# EAGLE schematic Drobit_V2.0 (EAGLE 7.5.0)

## Sheet 1 of 14: IMU
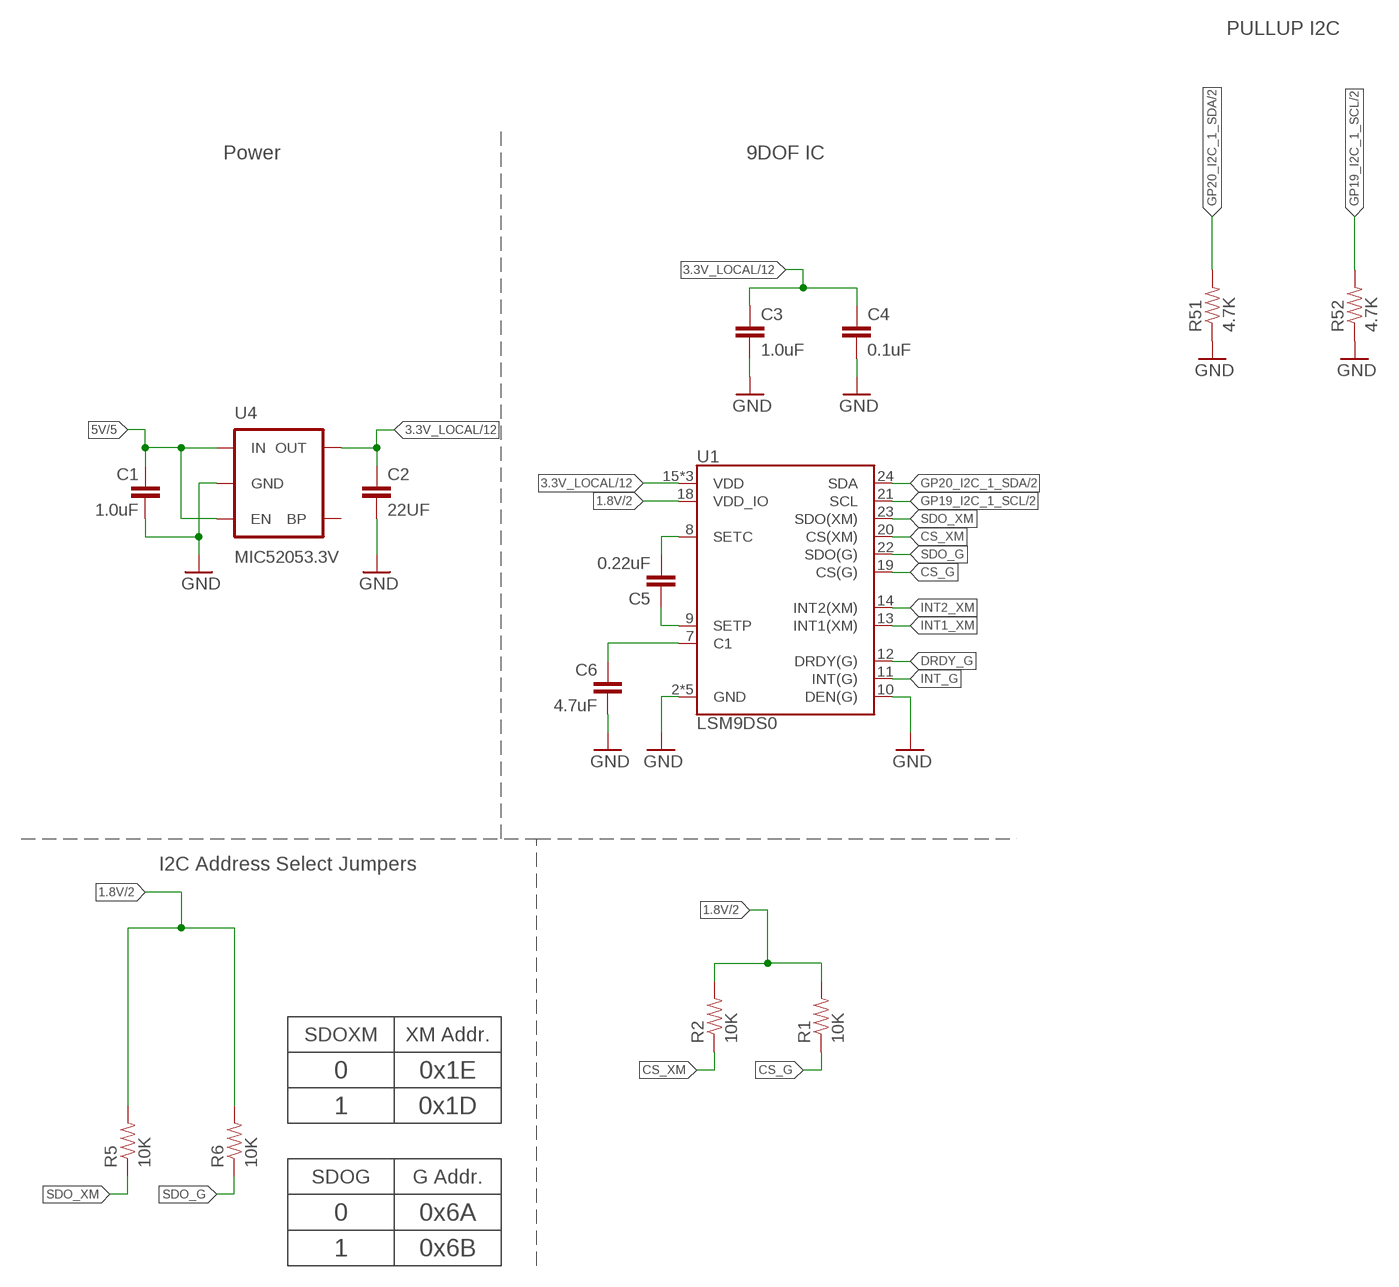
[diagram p0: schematic, sheet 1]

### Parts
C1  1.0uF  1.0UF-16V-10%(0603)  [0603-CAP]
C2  22UF  22UF-10V(0603)  [0603-CAP]
C3  1.0uF  1.0UF-16V-10%(0603)  [0603-CAP]
C4  0.1uF  0.1UF-25V(+80/-20%)(0603)  [0603-CAP]
C5  0.22uF  0.22UF-16V-10%(0603)  [0603-CAP]
C6  4.7uF  4.7UF-6.3V-10%(0603)0603  [0603-CAP]
R1  10K  10KOHM-1/10W-1%(0603)0603  [0603-RES]
R2  10K  10KOHM-1/10W-1%(0603)0603  [0603-RES]
R5  10K  10KOHM-1/10W-1%(0603)0603  [0603-RES]
R6  10K  10KOHM-1/10W-1%(0603)0603  [0603-RES]
R51  4.7K  4.7KOHM-1/10W-1%(0603)  [0603-RES]
R52  4.7K  4.7KOHM-1/10W-1%(0603)  [0603-RES]
U1  LSM9DS0  [LGA-24]
U4  MIC52053.3V  [SOT23-5]

### Nets
1.8V: R1.2 R2.2 R5.2 R6.2 U1.18(VDD_IO) ; also sheet 2,8,9,10,11,12
3.3V_LOCAL: C2.1 C3.1 C4.1 U1.15(VDD) U1.16(VDD) U1.17(VDD) U4.5(OUT) ; also sheet 12
5V [power]: C1.1 U4.1(IN) U4.3(EN) ; also sheet 5,6,7,10,11
CS_G: R1.1 U1.19(CS(G))
CS_XM: R2.1 U1.20(CS(XM))
DRDY_G: U1.12(DRDY(G))
GND: C1.2 C2.2 C3.2 C4.2 C6.2 R51.1 R52.1 U1.2(GND) U1.3(GND) U1.4(GND) U1.5(GND) U1.6(GND) U1.10(DEN(G)) U4.2(GND) ; also sheet 2,3,4,5,6,7,8,9,10,11,12,14
GP19_I2C_1_SCL: R52.2 U1.21(SCL) ; also sheet 2
GP20_I2C_1_SDA: R51.2 U1.24(SDA) ; also sheet 2
INT1_XM: U1.13(INT1(XM))
INT2_XM: U1.14(INT2(XM))
INT_G: U1.11(INT(G))
N$1: C5.1 U1.9(SETP)
N$2: C5.2 U1.8(SETC)
N$3: C6.1 U1.7(C1)
SDO_G: R6.1 U1.22(SDO(G))
SDO_XM: R5.1 U1.23(SDO(XM))
Unconnected: U4.4(BP)

### Notes on the sheet
- PULLUP I2C
- Power | 9DOF IC
- I2C Address Select Jumpers
- SDOXM | XM Addr.
- 0 | 0x1E
- 1 | 0x1D
- SDOG | G Addr.
- 0 | 0x6A
- 1 | 0x6B

## Sheet 2 of 14: EDISON
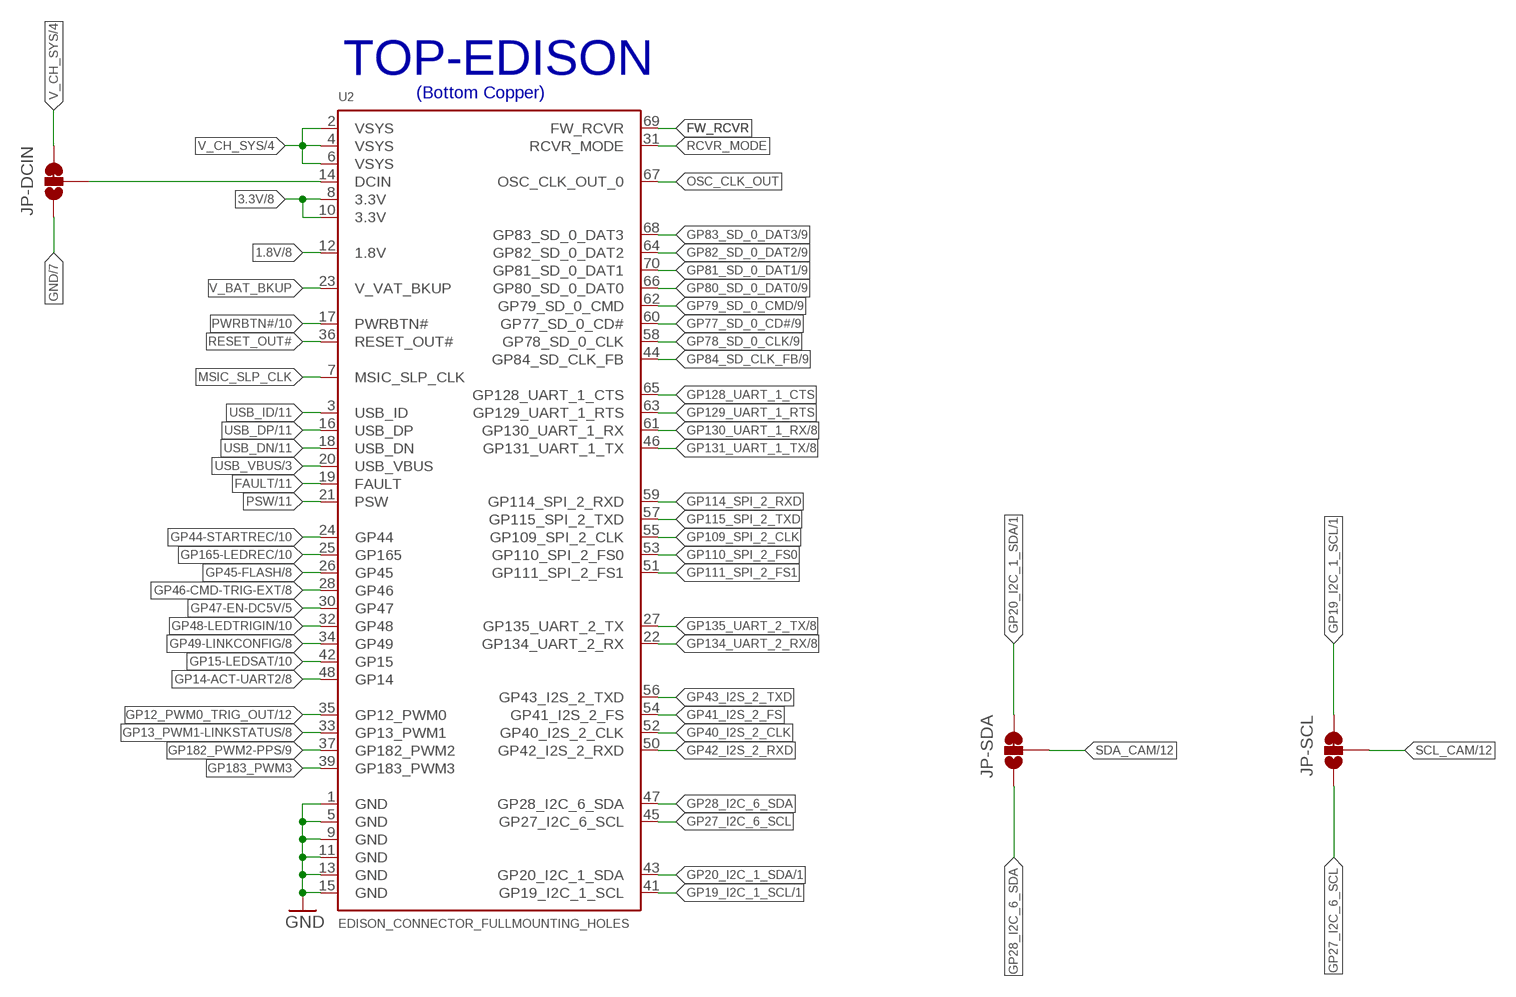
[diagram p1: schematic, sheet 2]

### Parts
JP-DCIN  JUMPER-PAD-3-2OF3_NC_BY_TRACE_SMALL  [PAD-JUMPER-3-2OF3_NC_BY_TRACE_YES_SILK_FULL_BOX]
JP-SCL  JUMPER-PAD-3-2OF3_NC_BY_TRACE_SMALL  [PAD-JUMPER-3-2OF3_NC_BY_TRACE_YES_SILK_FULL_BOX]
JP-SDA  JUMPER-PAD-3-2OF3_NC_BY_TRACE_SMALL  [PAD-JUMPER-3-2OF3_NC_BY_TRACE_YES_SILK_FULL_BOX]
U2  EDISON_CONNECTOR_FULLMOUNTING_HOLES  [EDISON_DAUGHTER]

### Nets
1.8V: U2.12(1.8V) ; also sheet 1,8,9,10,11,12
3.3V: U2.8(3.3V) U2.10(3.3V) ; also sheet 8,9,10,12
FAULT: U2.19(FAULT) ; also sheet 11
FW_RCVR: U2.69(FW_RCVR)
GND: JP-DCIN.1 U2.1(GND) U2.5(GND) U2.9(GND) U2.11(GND) U2.13(GND) U2.15(GND) ; also sheet 1,3,4,5,6,7,8,9,10,11,12,14
GP12_PWM0_TRIG_OUT: U2.35(GP12_PWM0) ; also sheet 12
GP13_PWM1-LINKSTATUS: U2.33(GP13_PWM1) ; also sheet 8
GP14-ACT-UART2: U2.48(GP14) ; also sheet 8
GP15-LEDSAT: U2.42(GP15) ; also sheet 10
GP19_I2C_1_SCL: JP-SCL.3 U2.41(GP19_I2C_1_SCL) ; also sheet 1
GP20_I2C_1_SDA: JP-SDA.3 U2.43(GP20_I2C_1_SDA) ; also sheet 1
GP27_I2C_6_SCL: JP-SCL.1 U2.45(GP27_I2C_6_SCL)
GP28_I2C_6_SDA: JP-SDA.1 U2.47(GP28_I2C_6_SDA)
GP40_I2S_2_CLK: U2.52(GP40_I2S_2_CLK)
GP41_I2S_2_FS: U2.54(GP41_I2S_2_FS)
GP42_I2S_2_RXD: U2.50(GP42_I2S_2_RXD)
GP43_I2S_2_TXD: U2.56(GP43_I2S_2_TXD)
GP44-STARTREC: U2.24(GP44) ; also sheet 10,12
GP45-FLASH: U2.26(GP45) ; also sheet 8
GP46-CMD-TRIG-EXT: U2.28(GP46) ; also sheet 8
GP47-EN-DC5V: U2.30(GP47) ; also sheet 5
GP48-LEDTRIGIN: U2.32(GP48) ; also sheet 10
GP49-LINKCONFIG: U2.34(GP49) ; also sheet 8
GP77_SD_0_CD#: U2.60(GP77_SD_0_CD#) ; also sheet 9
GP78_SD_0_CLK: U2.58(GP78_SD_0_CLK) ; also sheet 9
GP79_SD_0_CMD: U2.62(GP79_SD_0_CMD) ; also sheet 9
GP80_SD_0_DAT0: U2.66(GP80_SD_0_DAT0) ; also sheet 9
GP81_SD_0_DAT1: U2.70(GP81_SD_0_DAT1) ; also sheet 9
GP82_SD_0_DAT2: U2.64(GP82_SD_0_DAT2) ; also sheet 9
GP83_SD_0_DAT3: U2.68(GP83_SD_0_DAT3) ; also sheet 9
GP84_SD_CLK_FB: U2.44(GP84_SD_CLK_FB) ; also sheet 9
GP109_SPI_2_CLK: U2.55(GP109_SPI_2_CLK)
GP110_SPI_2_FS0: U2.53(GP110_SPI_2_FS0)
GP111_SPI_2_FS1: U2.51(GP111_SPI_2_FS1)
GP114_SPI_2_RXD: U2.59(GP114_SPI_2_RXD)
GP115_SPI_2_TXD: U2.57(GP115_SPI_2_TXD)
GP128_UART_1_CTS: U2.65(GP128_UART_1_CTS)
GP129_UART_1_RTS: U2.63(GP129_UART_1_RTS)
GP130_UART_1_RX: U2.61(GP130_UART_1_RX) ; also sheet 8
GP131_UART_1_TX: U2.46(GP131_UART_1_TX) ; also sheet 8
GP134_UART_2_RX: U2.22(GP134_UART_2_RX) ; also sheet 8
GP135_UART_2_TX: U2.27(GP135_UART_2_TX) ; also sheet 8
GP165-LEDREC: U2.25(GP165) ; also sheet 10
GP182_PWM2-PPS: U2.37(GP182_PWM2) ; also sheet 9
GP183_PWM3: U2.39(GP183_PWM3)
MSIC_SLP_CLK: U2.7(MSIC_SLP_CLK)
N$32: JP-DCIN.2 U2.14(DCIN)
OSC_CLK_OUT: U2.67(OSC_CLK_OUT_0)
PSW: U2.21(PSW) ; also sheet 11
PWRBTN#: U2.17(PWRBTN#) ; also sheet 10
RCVR_MODE: U2.31(RCVR_MODE)
RESET_OUT#: U2.36(RESET_OUT#)
SCL_CAM: JP-SCL.2 ; also sheet 12
SDA_CAM: JP-SDA.2 ; also sheet 12
USB_DN: U2.18(USB_DN) ; also sheet 11
USB_DP: U2.16(USB_DP) ; also sheet 11
USB_ID: U2.3(USB_ID) ; also sheet 11
USB_VBUS: U2.20(USB_VBUS) ; also sheet 3,11
V_BAT_BKUP: U2.23(V_VAT_BKUP)
V_CH_SYS: JP-DCIN.3 U2.2(VSYS) U2.4(VSYS) U2.6(VSYS) ; also sheet 4,5,10

### Notes on the sheet
- TOP-EDISON
- (Bottom Copper)

## Sheet 3 of 14: IN Protection
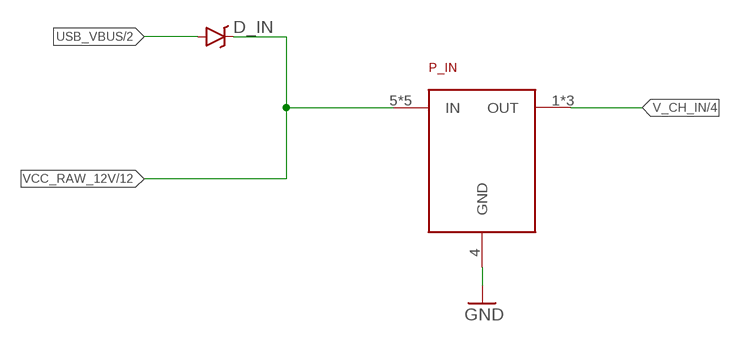
[diagram p2: schematic, sheet 3]

### Parts
D_IN  V8PAN50-M3/I  [V8PAN50-M3/I]
P_IN  FR014H5JZ  [FR014H5JZ]

### Nets
GND: P_IN.4(GND) ; also sheet 1,2,4,5,6,7,8,9,10,11,12,14
USB_VBUS: D_IN.A ; also sheet 2,11
V_CH_IN: P_IN.1(OUT) P_IN.2(OUT) P_IN.3(OUT) ; also sheet 4
VCC_RAW_12V: D_IN.C P_IN.5(IN) P_IN.6(IN) P_IN.7(IN) P_IN.8(IN) P_IN.PAD(IN) ; also sheet 12

## Sheet 4 of 14: CHARGER
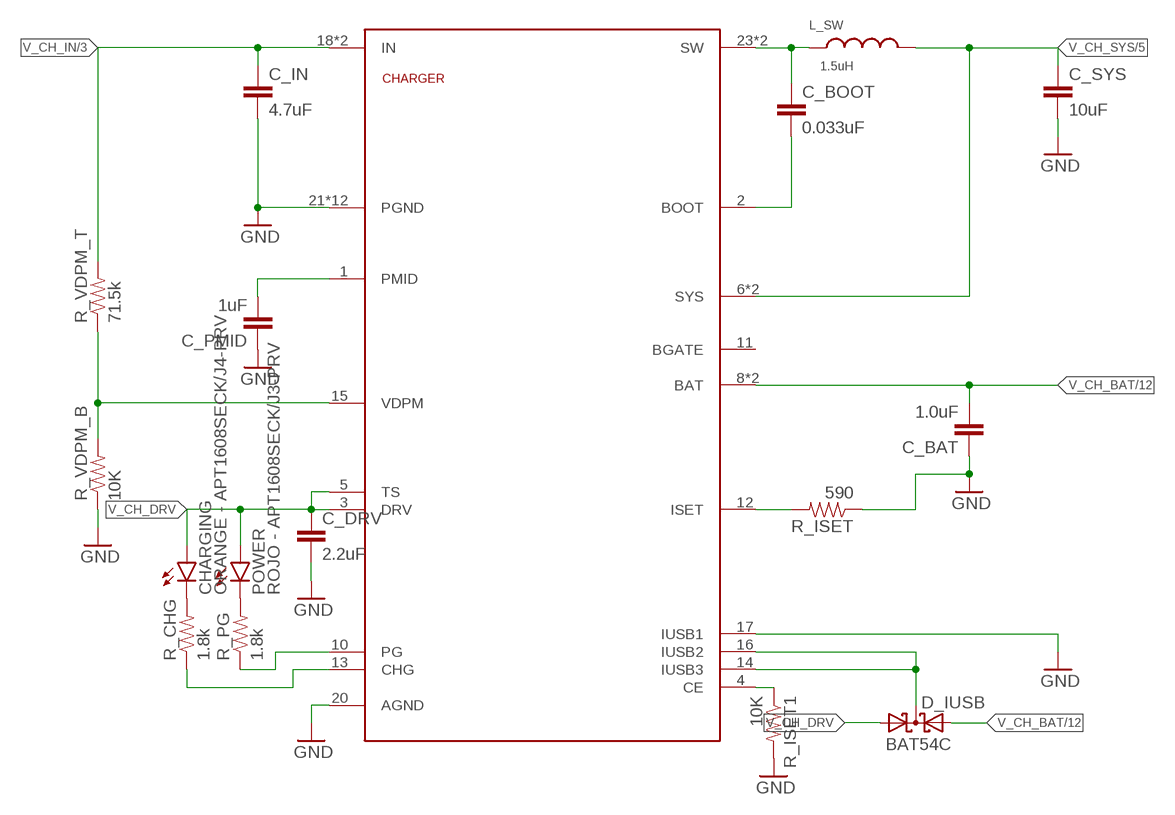
[diagram p3: schematic, sheet 4]

### Parts
C_BAT  1.0uF  1.0UF-16V-10%(0603)  [0603-CAP]
C_BOOT  0.033uF  33NF-50V-10%(0603)  [0603-CAP]
C_DRV  2.2uF  2.2UF-10V-20%(0603)  [0603-CAP]
C_IN  4.7uF  4.7UF-50V(0603)0603  [0603-CAP]
C_PMID  1uF  1UF-25V-10%(0603)  [0603-CAP]
C_SYS  10uF  10UF16V10%(1210)  [1210]
CHARGER  BQ24266  [QFN50P400X400X100-25N]
CHARGING  ORANGE - APT1608SECK/J4-PRV  LED0603  [LED-0603]
D_IUSB  BAT54C  [SOT23]
L_SW  1.5uH  FDSD0420-H-1R5M  [FDSD0420]
POWER  ROJO - APT1608SECK/J3-PRV  LED0603  [LED-0603]
R_CHG  1.8k  1.8KOHM1/10W1%(0603)  [0603-RES]
R_ISET  590  590OHM1/10W1%(0603)  [0603-RES]
R_ISET1  10K  10KOHM-1/10W-1%(0603)0603  [0603-RES]
R_PG  1.8k  1.8KOHM1/10W1%(0603)  [0603-RES]
R_VDPM_B  10K  10KOHM-1/10W-0.1%(0603)0603  [0603-RES]
R_VDPM_T  71.5k  71.5KOHM1/10W1%(0603)  [0603-RES]

### Nets
GND: C_BAT.1 C_DRV.2 C_IN.2 C_PMID.1 C_SYS.2 CHARGER.17(IUSB1) CHARGER.20(AGND) CHARGER.21(PGND) CHARGER.22(PGND) CHARGER.25(PGND) CHARGER.P$2(PGND) CHARGER.P$3(PGND) CHARGER.P$4(PGND) CHARGER.P$5(PGND) CHARGER.P$6(PGND) CHARGER.P$7(PGND) CHARGER.P$8(PGND) CHARGER.P$9(PGND) CHARGER.P$10(PGND) R_ISET1.2 R_ISET.1 R_VDPM_B.1 ; also sheet 1,2,3,5,6,7,8,9,10,11,12,14
N$16: CHARGER.4(CE) R_ISET1.1
N$17: POWER.C R_PG.2
N$18: CHARGING.C R_CHG.2
N$19: CHARGER.10(PG) R_PG.1
N$20: CHARGER.13(CHG) R_CHG.1
N$22: C_BOOT.2 CHARGER.2(BOOT)
N$24: CHARGER.12(ISET) R_ISET.2
N$25: CHARGER.14(IUSB3) CHARGER.16(IUSB2) D_IUSB.3(CC)
V_CH_BAT: C_BAT.2 CHARGER.8(BAT) CHARGER.9(BAT) D_IUSB.2(A2) ; also sheet 12
V_CH_DPM: CHARGER.15(VDPM) R_VDPM_B.2 R_VDPM_T.1
V_CH_DRV: C_DRV.1 CHARGER.3(DRV) CHARGER.5(TS) CHARGING.A D_IUSB.1(A1) POWER.A
V_CH_IN: C_IN.1 CHARGER.18(IN) CHARGER.19(IN) R_VDPM_T.2 ; also sheet 3
V_CH_PMID: C_PMID.2 CHARGER.1(PMID)
V_CH_SW: C_BOOT.1 CHARGER.23(SW) CHARGER.24(SW) L_SW.1
V_CH_SYS: C_SYS.1 CHARGER.6(SYS) CHARGER.7(SYS) L_SW.2 ; also sheet 2,5,10
Unconnected: CHARGER.11(BGATE)

## Sheet 5 of 14: DCDC-5V
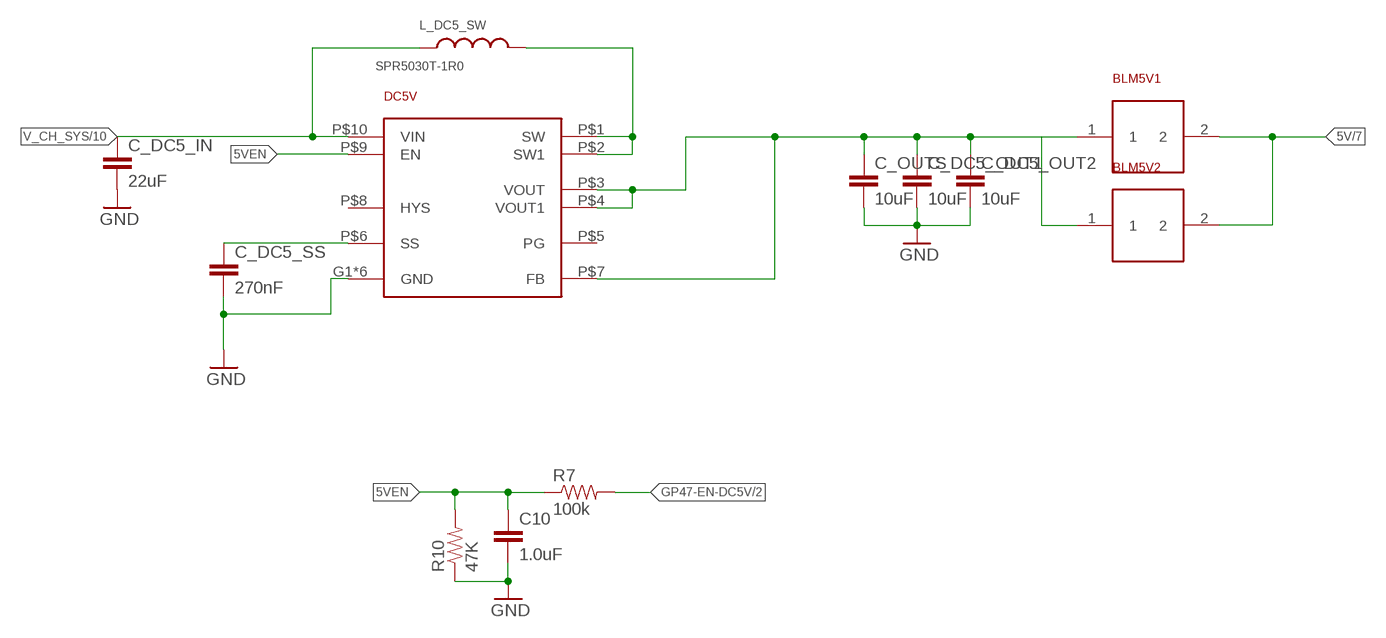
[diagram p4: schematic, sheet 5]

### Parts
BLM5V1  BLM18SG221TZ1-2.5A  [0603]
BLM5V2  BLM18SG221TZ1-2.5A  [0603]
C10  1.0uF  1.0UF-16V-10%(0603)  [0603-CAP]
C_DC5_IN  22uF  22UF-25V-20%-(1210)  [1210]
C_DC5_OUT1  10uF  10UF10V10%(1210)  [1210]
C_DC5_OUT2  10uF  10UF10V10%(1210)  [1210]
C_DC5_SS  270nF  270NF-16V(0603)  [0603-CAP]
C_OUTS  10uF  10UF10V10%(1210)  [1210]
DC5V  TPS61232  [SON-10]
L_DC5_SW  SPR5030T-1R0  [SRP5030T-1R0]
R7  100k  100KOHM-1/10W-1%(0603)  [0603-RES]
R10  47K  47KOHM1/10W1%(0603)  [0603-RES]

### Nets
5V [power]: BLM5V1.2 BLM5V2.2 ; also sheet 1,6,7,10,11
5VEN: C10.1 DC5V.P$9(EN) R7.1 R10.2
5VRAW: BLM5V1.1 BLM5V2.1 C_DC5_OUT1.1 C_DC5_OUT2.1 C_OUTS.1 DC5V.P$3(VOUT) DC5V.P$4(VOUT1) DC5V.P$7(FB)
GND: C10.2 C_DC5_IN.2 C_DC5_OUT1.2 C_DC5_OUT2.2 C_DC5_SS.2 C_OUTS.2 DC5V.G1(GND) DC5V.G2(GND) DC5V.G3(GND) DC5V.G4(GND) DC5V.G5(GND) DC5V.PAD(GND) R10.1 ; also sheet 1,2,3,4,6,7,8,9,10,11,12,14
GP47-EN-DC5V: R7.2 ; also sheet 2
V_CH_SYS: C_DC5_IN.1 DC5V.P$10(VIN) L_DC5_SW.P$1 ; also sheet 2,4,10
V_DC5_SS: C_DC5_SS.1 DC5V.P$6(SS)
V_DC5_SW: DC5V.P$1(SW) DC5V.P$2(SW1) L_DC5_SW.P$2
Unconnected: DC5V.P$5(PG) DC5V.P$8(HYS)

## Sheet 6 of 14: 5V-LIMIT
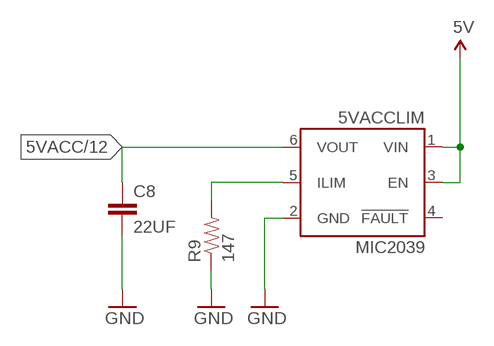
[diagram p5: schematic, sheet 6]

### Parts
5VACCLIM  MIC2039  [SOT23-6]
C8  22UF  22UF-10V(0603)  [0603-CAP]
R9  147  147OHM-1/16W-1%(0603)  [0603-RES]

### Nets
5V [power]: 5VACCLIM.1(VIN) 5VACCLIM.3(EN) ; also sheet 1,5,7,10,11
5VACC: 5VACCLIM.6(VOUT) C8.1 ; also sheet 12,14
GND: 5VACCLIM.2(GND) C8.2 R9.1 ; also sheet 1,2,3,4,5,7,8,9,10,11,12,14
N$31: 5VACCLIM.5(ILIM) R9.2
Unconnected: 5VACCLIM.4(!FAULT)

## Sheet 7 of 14: GNSS
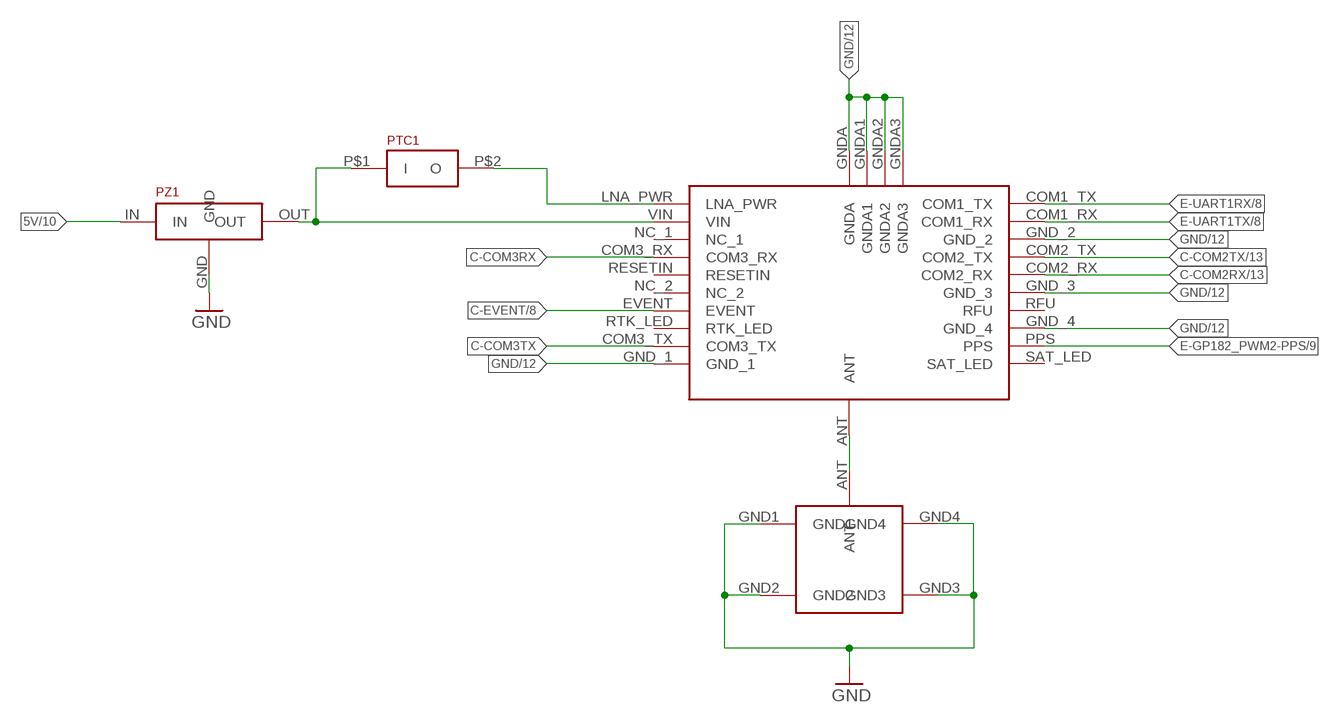
[diagram p6: schematic, sheet 7]

### Parts
PTC1  0603L010YR  [0602]
PZ1  ZEN056V230A16YC  [ZEN056V230A16YC]
U$1  COMNAV_501G  [COMNAV_501G]
U$2  MCX-TECON-1-1337586-0  [1-1337586-0]

### Nets
5V [power]: PZ1.IN ; also sheet 1,5,6,10,11
C-COM2RX: U$1.COM2_RX ; also sheet 13
C-COM2TX: U$1.COM2_TX ; also sheet 13
C-COM3RX: U$1.COM3_RX
C-COM3TX: U$1.COM3_TX
C-EVENT: U$1.EVENT ; also sheet 8,12,13
E-GP182_PWM2-PPS: U$1.PPS ; also sheet 9,13
E-UART1RX: U$1.COM1_TX ; also sheet 8
E-UART1TX: U$1.COM1_RX ; also sheet 8
GND: PZ1.GND U$1.GND_1 U$1.GND_2 U$1.GND_3 U$1.GND_4 U$1.GNDA U$1.GNDA1 U$1.GNDA2 U$1.GNDA3 U$2.GND1 U$2.GND2 U$2.GND3 U$2.GND4 ; also sheet 1,2,3,4,5,6,8,9,10,11,12,14
N$29: PTC1.P$2(O) U$1.LNA_PWR
N$30: PTC1.P$1(I) PZ1.OUT U$1.VIN
N$40: U$1.ANT U$2.ANT
Unconnected: U$1.NC_1 U$1.NC_2 U$1.RESETIN U$1.RFU U$1.RTK_LED U$1.SAT_LED

## Sheet 8 of 14: GPIO-UART
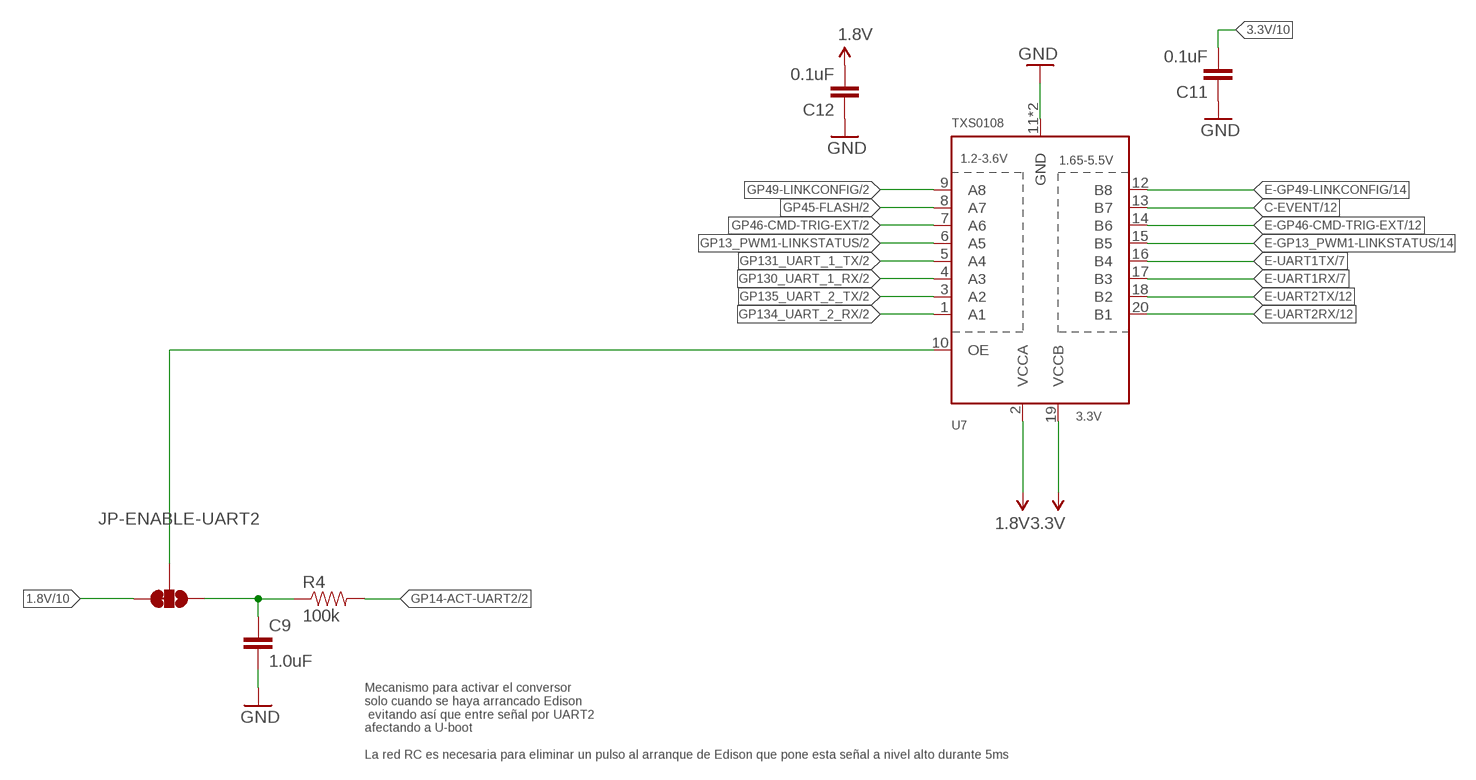
[diagram p7: schematic, sheet 8]

### Parts
C9  1.0uF  1.0UF-16V-10%(0603)  [0603-CAP]
C11  0.1uF  0.1UF-25V(+80/-20%)(0603)  [0603-CAP]
C12  0.1uF  0.1UF-25V(+80/-20%)(0603)  [0603-CAP]
JP-ENABLE-UART2  JUMPER-PAD-3-2OF3_NC_BY_TRACE_SMALL  [PAD-JUMPER-3-2OF3_NC_BY_TRACE_YES_SILK_FULL_BOX]
R4  100k  100KOHM-1/10W-1%(0603)  [0603-RES]
U7  TXS0108  [R-PVQFN-N20]

### Nets
1.8V: C12.2 JP-ENABLE-UART2.3 U7.2(VCCA) ; also sheet 1,2,9,10,11,12
3.3V: C11.2 U7.19(VCCB) ; also sheet 2,9,10,12
C-EVENT: U7.13(B7) ; also sheet 7,12,13
E-GP13_PWM1-LINKSTATUS: U7.15(B5) ; also sheet 14
E-GP46-CMD-TRIG-EXT: U7.14(B6) ; also sheet 12,13
E-GP49-LINKCONFIG: U7.12(B8) ; also sheet 14
E-UART1RX: U7.17(B3) ; also sheet 7
E-UART1TX: U7.16(B4) ; also sheet 7
E-UART2RX: U7.20(B1) ; also sheet 12,14
E-UART2TX: U7.18(B2) ; also sheet 12,14
GND: C9.2 C11.1 C12.1 U7.11(GND) U7.EPAD(GND) ; also sheet 1,2,3,4,5,6,7,9,10,11,12,14
GP13_PWM1-LINKSTATUS: U7.6(A5) ; also sheet 2
GP14: JP-ENABLE-UART2.2 U7.10(OE)
GP14-ACT-UART2: R4.2 ; also sheet 2
GP45-FLASH: U7.8(A7) ; also sheet 2
GP46-CMD-TRIG-EXT: U7.7(A6) ; also sheet 2
GP49-LINKCONFIG: U7.9(A8) ; also sheet 2
GP130_UART_1_RX: U7.4(A3) ; also sheet 2
GP131_UART_1_TX: U7.5(A4) ; also sheet 2
GP134_UART_2_RX: U7.1(A1) ; also sheet 2
GP135_UART_2_TX: U7.3(A2) ; also sheet 2
N$13: C9.1 JP-ENABLE-UART2.1 R4.1

### Notes on the sheet
- Mecanismo para activar el conversor
  solo cuando se haya arrancado Edison
   evitando así que entre señal por UART2
  afectando a U-boot
  
  La red RC es necesaria para eliminar un pulso al arranque de Edison que pone esta señal a nivel alto durante 5ms

## Sheet 9 of 14: SDCARD
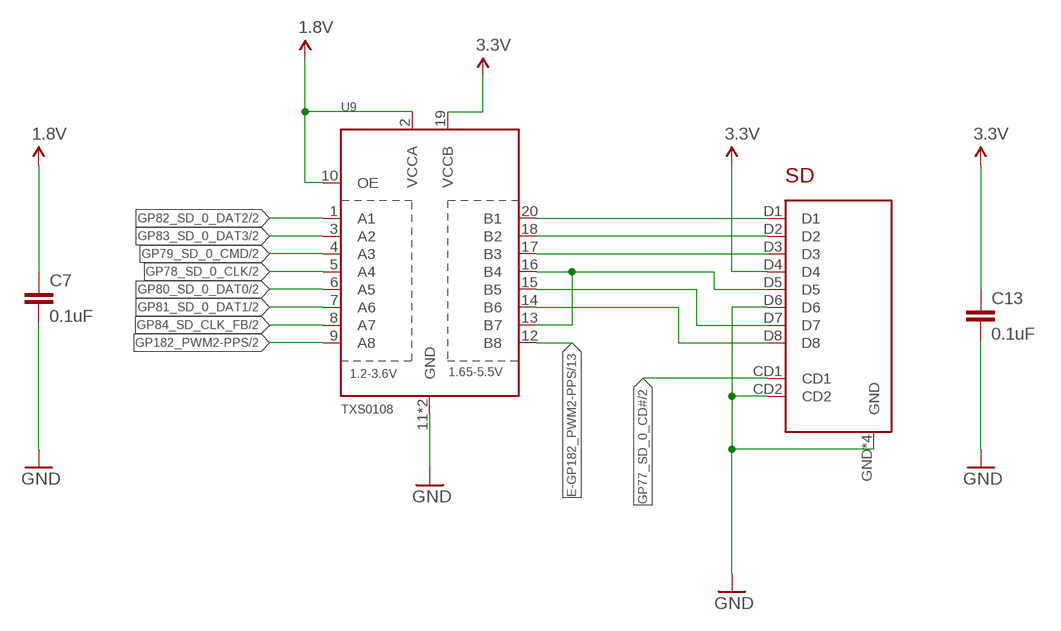
[diagram p8: schematic, sheet 9]

### Parts
C7  0.1uF  0.1UF-25V(+80/-20%)(0603)  [0603-CAP]
C13  0.1uF  0.1UF-25V(+80/-20%)(0603)  [0603-CAP]
SD  SDCARD  [1040310811]
U9  TXS0108  [R-PVQFN-N20]

### Nets
1.8V: C7.1 U9.2(VCCA) U9.10(OE) ; also sheet 1,2,8,10,11,12
3.3V: C13.1 SD.D4 U9.19(VCCB) ; also sheet 2,8,10,12
E-GP182_PWM2-PPS: U9.12(B8) ; also sheet 7,13
GND: C7.2 C13.2 SD.CD2 SD.D6 SD.GND SD.GND1(GND) SD.GND2(GND) SD.GND3(GND) U9.11(GND) U9.EPAD(GND) ; also sheet 1,2,3,4,5,6,7,8,10,11,12,14
GP77_SD_0_CD#: SD.CD1 ; also sheet 2
GP78_SD_0_CLK: U9.5(A4) ; also sheet 2
GP79_SD_0_CMD: U9.4(A3) ; also sheet 2
GP80_SD_0_DAT0: U9.6(A5) ; also sheet 2
GP81_SD_0_DAT1: U9.7(A6) ; also sheet 2
GP82_SD_0_DAT2: U9.1(A1) ; also sheet 2
GP83_SD_0_DAT3: U9.3(A2) ; also sheet 2
GP84_SD_CLK_FB: U9.8(A7) ; also sheet 2
GP182_PWM2-PPS: U9.9(A8) ; also sheet 2
N$4: SD.D1 U9.20(B1)
N$5: SD.D2 U9.18(B2)
N$10: SD.D3 U9.17(B3)
N$11: SD.D7 U9.15(B5)
N$14: SD.D8 U9.14(B6)
SCK: SD.D5 U9.13(B7) U9.16(B4)

## Sheet 10 of 14: Buttons&LEDs
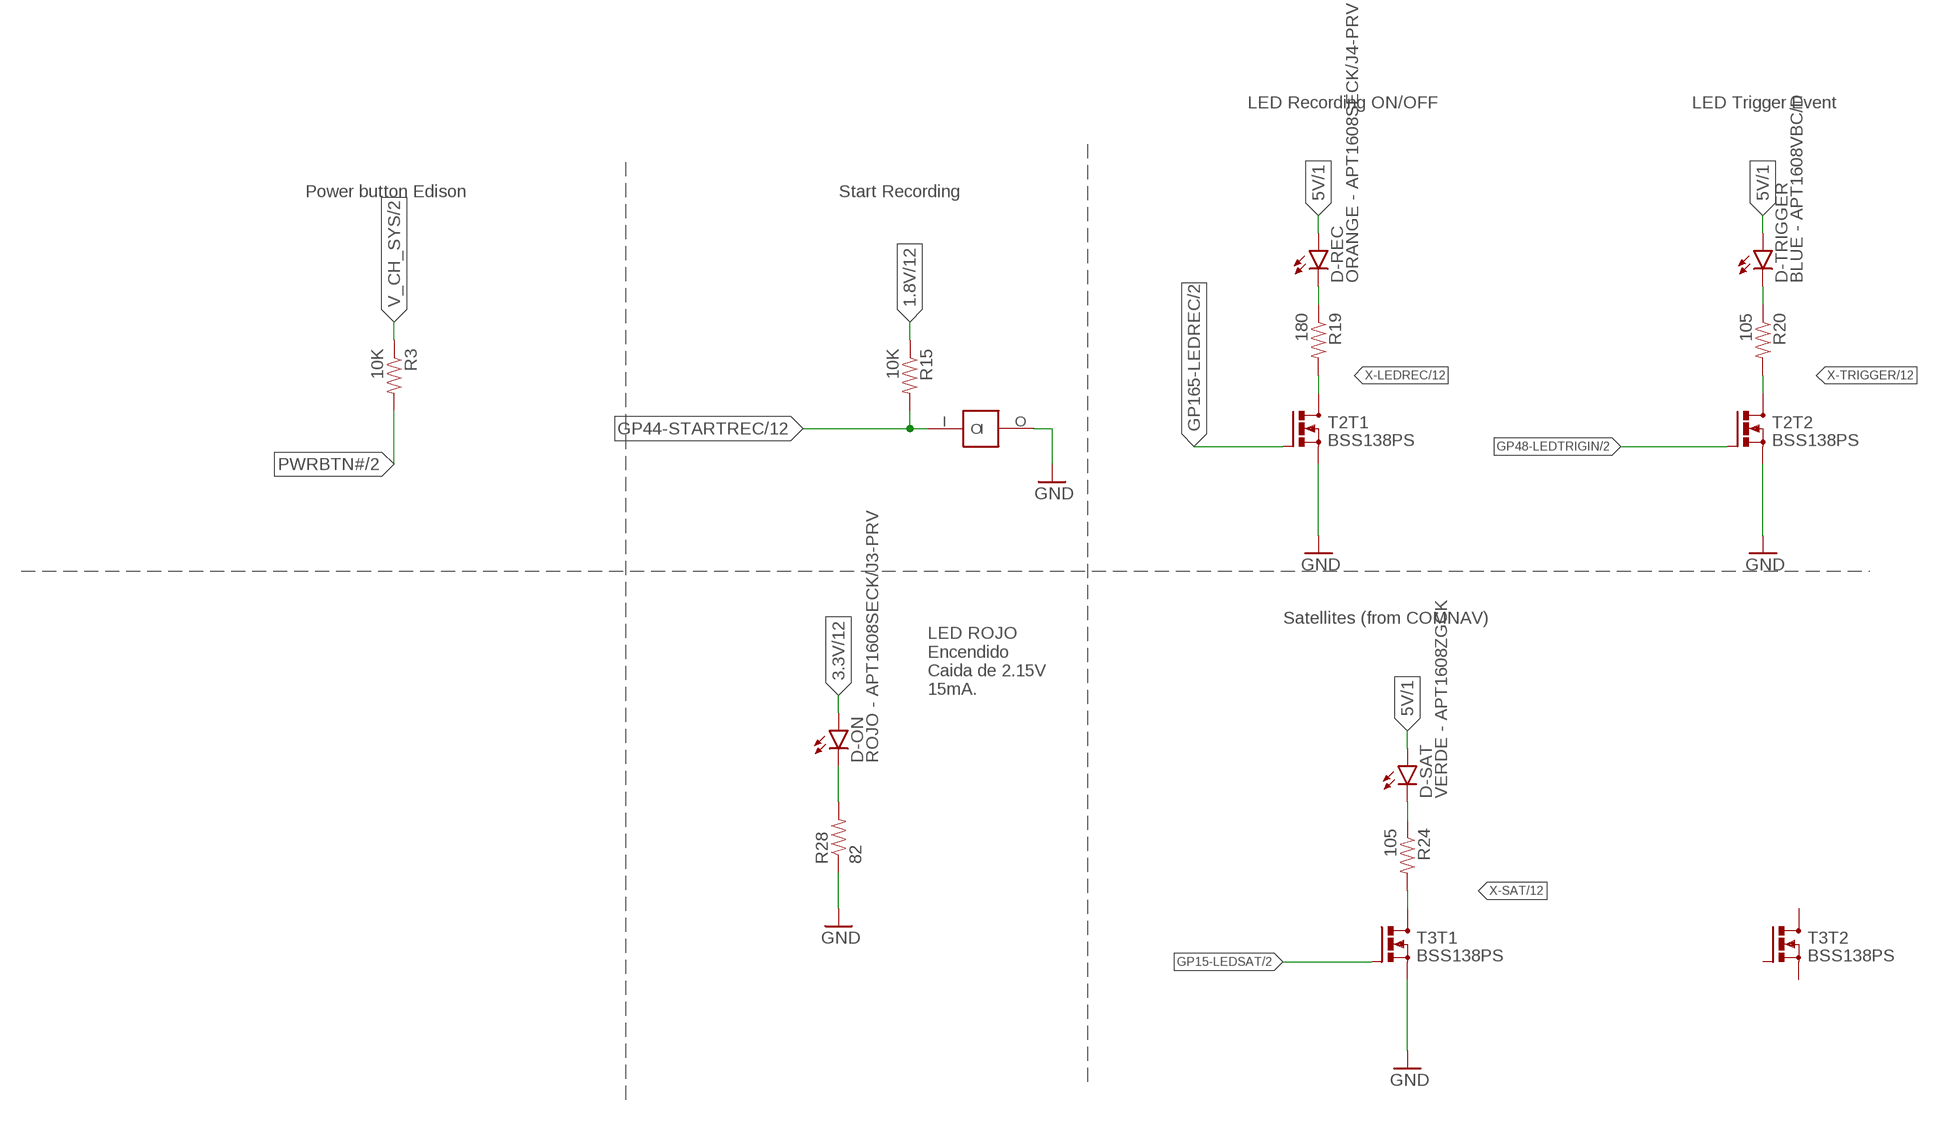
[diagram p9: schematic, sheet 10]

### Parts
D-ON  ROJO - APT1608SECK/J3-PRV  LED0603  [LED-0603]
D-REC  ORANGE - APT1608SECK/J4-PRV  LED0603  [LED-0603]
D-SAT  VERDE - APT1608ZGCK  LED0603  [LED-0603]
D-TRIGGER  BLUE - APT1608VBC/D  LED0603  [LED-0603]
R3  10K  10KOHM-1/10W-1%(0603)0603  [0603-RES]
R15  10K  10KOHM-1/10W-1%(0603)0603  [0603-RES]
R19  180  180OHM1/10W1%(0603)  [0603-RES]
R20  105  105OHM-1/10W-1%(0603)  [0603-RES]
R24  105  105OHM-1/10W-1%(0603)  [0603-RES]
R28  82  82OHM-1/10W-1%(0603)SMD  [0603-RES]
SREC  SKRKAEE010  [SKRKAEE010]
T2  BSS138PS  [SOT363]
T3  BSS138PS  [SOT363]

### Nets
1.8V: R15.1 ; also sheet 1,2,8,9,11,12
3.3V: D-ON.A ; also sheet 2,8,9,12
5V [power]: D-REC.A D-SAT.A D-TRIGGER.A ; also sheet 1,5,6,7,11
GND: R28.1 SREC.O T2.1(T1:S) T2.4(T2:S) T3.1(T1:S) ; also sheet 1,2,3,4,5,6,7,8,9,11,12,14
GP15-LEDSAT: T3.2(T1:G) ; also sheet 2
GP44-STARTREC: R15.2 SREC.I ; also sheet 2,12
GP48-LEDTRIGIN: T2.5(T2:G) ; also sheet 2
GP165-LEDREC: T2.2(T1:G) ; also sheet 2
N$9: D-ON.C R28.2
PWRBTN#: R3.2 ; also sheet 2
V_CH_SYS: R3.1 ; also sheet 2,4,5
X-LEDREC: R19.2 T2.6(T1:D) ; also sheet 12
X-LEDREC--: D-REC.C R19.1
X-SAT: R24.2 T3.6(T1:D) ; also sheet 12
X-SAT--: D-SAT.C R24.1
X-TRIGGER: R20.2 T2.3(T2:D) ; also sheet 12
X-TRIGGER--: D-TRIGGER.C R20.1
Unconnected: T3.3(T2:D) T3.4(T2:S) T3.5(T2:G)

### Notes on the sheet
- LED Recording ON/OFF | LED Trigger Event
- Power button Edison | Start Recording
- Satellites (from COMNAV)
- LED ROJO
  Encendido
  Caida de 2.15V
  15mA.

## Sheet 11 of 14: USB
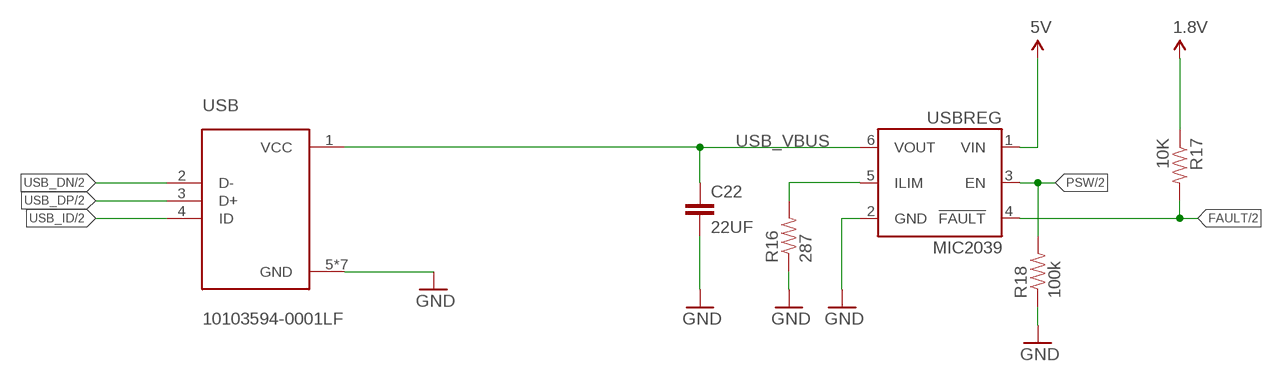
[diagram p10: schematic, sheet 11]

### Parts
C22  22UF  22UF-10V(0603)  [0603-CAP]
R16  287  287OHM-1/10W-1%(0603)  [0603-RES]
R17  10K  10KOHM-1/10W-1%(0603)0603  [0603-RES]
R18  100k  100KOHM-1/10W-1%(0603)  [0603-RES]
USB  10103594-0001LF  [POS-5]
USBREG  MIC2039  [SOT23-6]

### Nets
1.8V: R17.1 ; also sheet 1,2,8,9,10,12
5V [power]: USBREG.1(VIN) ; also sheet 1,5,6,7,10
FAULT: R17.2 USBREG.4(!FAULT) ; also sheet 2
GND: C22.2 R16.1 R18.1 USB.5(GND) USB.PAD1(GND) USB.PAD2(GND) USB.PAD3(GND) USB.PAD4(GND) USB.PAD5(GND) USB.PAD6(GND) USBREG.2(GND) ; also sheet 1,2,3,4,5,6,7,8,9,10,12,14
N$15: R16.2 USBREG.5(ILIM)
PSW: R18.2 USBREG.3(EN) ; also sheet 2
USB_DN: USB.2(D-) ; also sheet 2
USB_DP: USB.3(D+) ; also sheet 2
USB_ID: USB.4(ID) ; also sheet 2
USB_VBUS: C22.1 USB.1(VCC) USBREG.6(VOUT) ; also sheet 2,3

## Sheet 12 of 14: Connectors
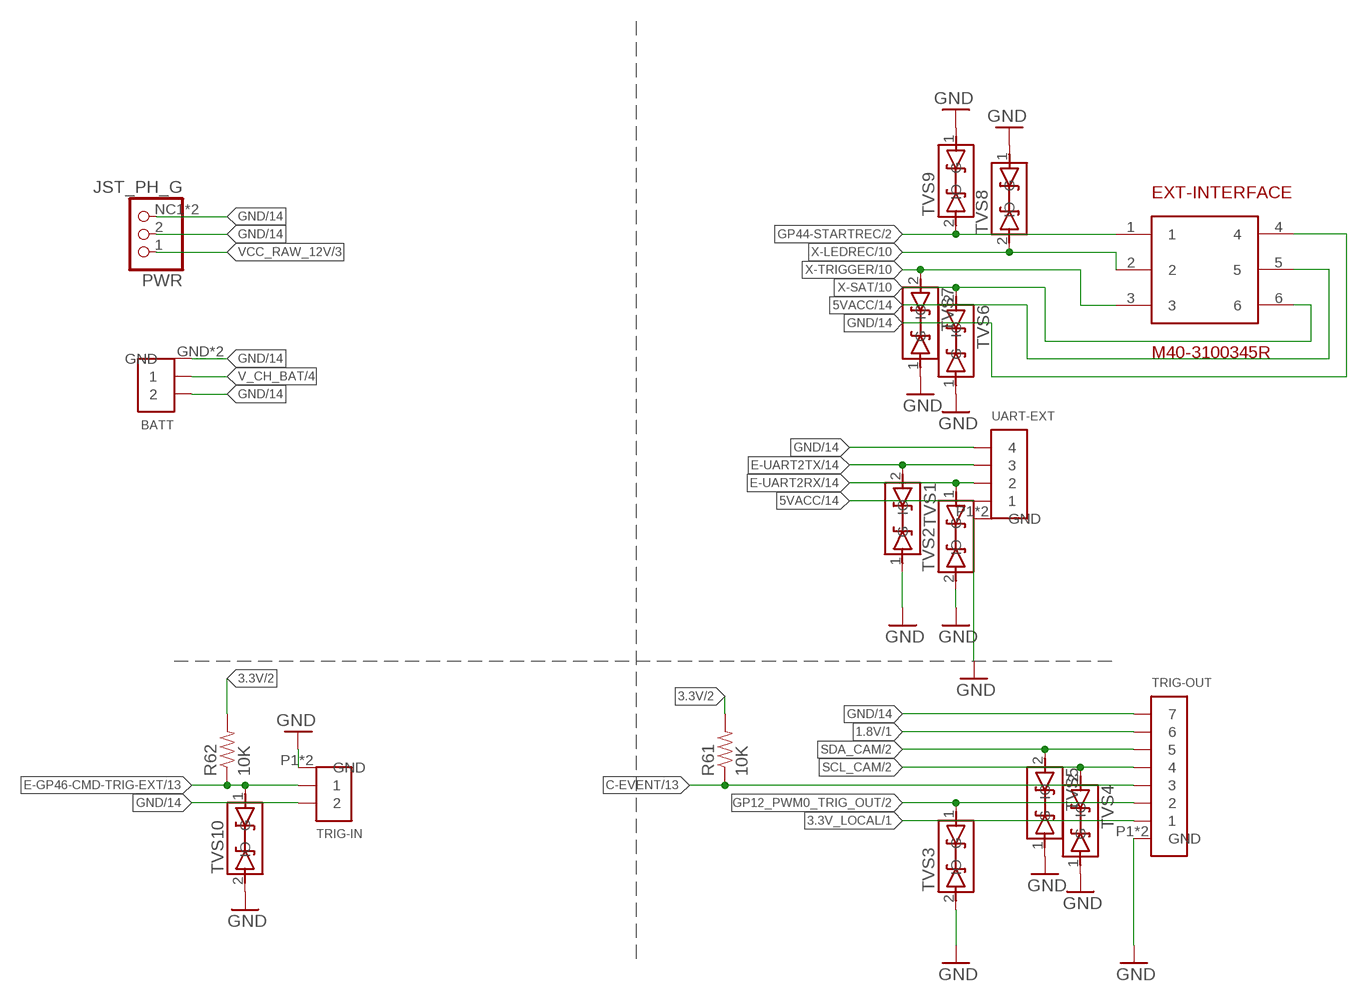
[diagram p11: schematic, sheet 12]

### Parts
BATT  CONN_2-1-SFH  [SM02B-SFHRS-TF]
EXT-INTERFACE  M40-3100345R  [M40-3100345R]
PWR  JST_PH_G  [JST-PH-2-SMT-RA]
R61  10K  10KOHM-1/10W-1%(0603)0603  [0603-RES]
R62  10K  10KOHM-1/10W-1%(0603)0603  [0603-RES]
TRIG-IN  CONN_2-1  [JST-GH-2]
TRIG-OUT  CONN_7-1  [JST-GH-7]
TVS1  LXES15AAA1-133  [1005]
TVS2  LXES15AAA1-133  [1005]
TVS3  LXES15AAA1-133  [1005]
TVS4  LXES15AAA1-133  [1005]
TVS5  LXES15AAA1-133  [1005]
TVS6  LXES15AAA1-133  [1005]
TVS7  LXES15AAA1-133  [1005]
TVS8  LXES15AAA1-133  [1005]
TVS9  LXES15AAA1-133  [1005]
TVS10  LXES15AAA1-133  [1005]
UART-EXT  CONN_4-1  [JST-GH-4]

### Nets
1.8V: TRIG-OUT.6 ; also sheet 1,2,8,9,10,11
3.3V: R61.2 R62.2 ; also sheet 2,8,9,10
3.3V_LOCAL: TRIG-OUT.1 ; also sheet 1
5VACC: EXT-INTERFACE.5 UART-EXT.1 ; also sheet 6,14
C-EVENT: R61.1 TRIG-OUT.3 ; also sheet 7,8,13
E-GP46-CMD-TRIG-EXT: R62.1 TRIG-IN.1 TVS10.1(G) ; also sheet 8,13
E-UART2RX: TVS2.1(G) UART-EXT.2 ; also sheet 8,14
E-UART2TX: TVS1.2(IO) UART-EXT.3 ; also sheet 8,14
GND: BATT.2 BATT.GND BATT.GND1(GND) EXT-INTERFACE.4 PWR.2 PWR.NC1 PWR.NC2 TRIG-IN.2 TRIG-IN.P1(GND) TRIG-IN.P2(GND) TRIG-OUT.7 TRIG-OUT.P1(GND) TRIG-OUT.P2(GND) TVS1.1(G) TVS2.2(IO) TVS3.2(IO) TVS4.1(G) TVS5.1(G) TVS6.1(G) TVS7.1(G) TVS8.1(G) TVS9.1(G) TVS10.2(IO) UART-EXT.4 UART-EXT.P1(GND) UART-EXT.P2(GND) ; also sheet 1,2,3,4,5,6,7,8,9,10,11,14
GP12_PWM0_TRIG_OUT: TRIG-OUT.2 TVS3.1(G) ; also sheet 2
GP44-STARTREC: EXT-INTERFACE.1 TVS9.2(IO) ; also sheet 2,10
SCL_CAM: TRIG-OUT.4 TVS4.2(IO) ; also sheet 2
SDA_CAM: TRIG-OUT.5 TVS5.2(IO) ; also sheet 2
V_CH_BAT: BATT.1 ; also sheet 4
VCC_RAW_12V: PWR.1 ; also sheet 3
X-LEDREC: EXT-INTERFACE.2 TVS8.2(IO) ; also sheet 10
X-SAT: EXT-INTERFACE.6 TVS6.2(IO) ; also sheet 10
X-TRIGGER: EXT-INTERFACE.3 TVS7.2(IO) ; also sheet 10

## Sheet 13 of 14: Pads
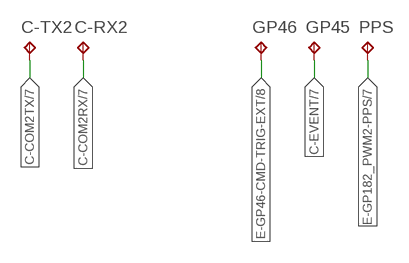
[diagram p12: schematic, sheet 13]

### Parts
C-RX2  TPTP08R  [TP08R]
C-TX2  TPTP08R  [TP08R]
GP45  TPTP08R  [TP08R]
GP46  TPTP08R  [TP08R]
PPS  TPTP08R  [TP08R]

### Nets
C-COM2RX: C-RX2.TP ; also sheet 7
C-COM2TX: C-TX2.TP ; also sheet 7
C-EVENT: GP45.TP ; also sheet 7,8,12
E-GP46-CMD-TRIG-EXT: GP46.TP ; also sheet 8,12
E-GP182_PWM2-PPS: PPS.TP ; also sheet 7,9

## Sheet 14 of 14: RadioLink
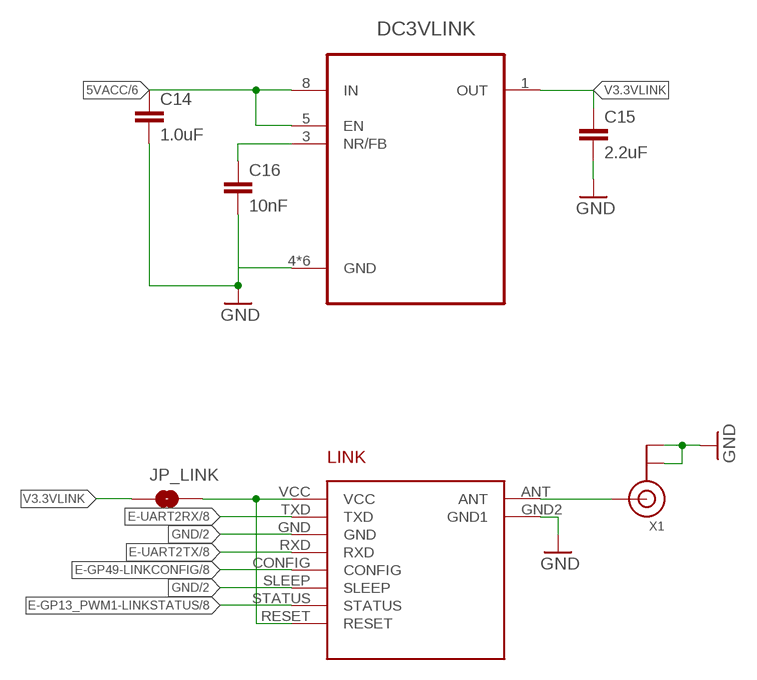
[diagram p13: schematic, sheet 14]

### Parts
C14  1.0uF  1.0UF-16V-10%(0603)  [0603-CAP]
C15  2.2uF  2.2UF-10V-20%(0603)  [0603-CAP]
C16  10nF  10NF/10000PF-50V-10%(0603)  [0603-CAP]
DC3VLINK  TPS73501DRBT  [SON65P300X300X100-9N]
JP_LINK  JUMPER-PAD-2-NOYES_SILK  [PAD-JUMPER-2-NO_YES_SILK]
LINK  HM-TRLR-S  [HM-TRLR-S]
X1  ANTENNA_U.FL-A-1JB  [U.FL-A-1JB]

### Nets
5VACC: C14.1 DC3VLINK.5(EN) DC3VLINK.8(IN) ; also sheet 6,12
E-GP13_PWM1-LINKSTATUS: LINK.STATUS ; also sheet 8
E-GP49-LINKCONFIG: LINK.CONFIG ; also sheet 8
E-UART2RX: LINK.TXD ; also sheet 8,12
E-UART2TX: LINK.RXD ; also sheet 8,12
GND: C14.2 C15.2 C16.2 DC3VLINK.4(GND) DC3VLINK.GND DC3VLINK.GND1(GND) DC3VLINK.GND2(GND) DC3VLINK.GND3(GND) DC3VLINK.GND4(GND) LINK.GND LINK.GND2(GND1) LINK.SLEEP X1.1(GND) X1.2(GND) ; also sheet 1,2,3,4,5,6,7,8,9,10,11,12
N$28: C16.1 DC3VLINK.3(NR/FB)
N$37: JP_LINK.2 LINK.RESET LINK.VCC
N$41: LINK.ANT X1.3(SIGNAL)
V3.3VLINK: C15.1 DC3VLINK.1(OUT) JP_LINK.1

## Library data of the parts
5VACCLIM USBREG = Testing:MIC2039; PARTNO: 998-MIC2039EYM6T5
BATT = jst-gh:CONN_2-1; PARTNO: 455-2524-1-ND
BLM5V1 BLM5V2 = BLM-ferrite:BLM18SG221TZ1-2.5A; PARTNO: 81-BLM18SG221TZ1D
C1 C3 C9 C10 C14 C_BAT = SparkFun-Capacitors:1.0UF-16V-10%(0603): CAP-00868; PARTNO: 810-CGA3E1X7R1E105K; PROD_ID: CAP-00868
C2 C8 C22 = SparkFun-Capacitors:22UF-10V(0603): CAP-09137; PARTNO: 810-C1608X5R1A226M; PROD_ID: CAP-09137
C4 C7 C11-C13 = SparkFun-Capacitors:0.1UF-25V(+80/-20%)(0603): CAP-00810 Ceramic Standard decoupling cap; PARTNO: 810-CGA3E2X7R1E104K; PROD_ID: CAP-00810
C5 = SparkFun-Capacitors:0.22UF-16V-10%(0603): CAP-07822; PARTNO: 810-C1608X7R1C224K; PROD_ID: CAP-07822
C6 = SparkFun-Capacitors:4.7UF-6.3V-10%(0603): CAP-08280; PARTNO: 81-GRM18R60J475KE19D; PROD_ID: CAP-08280
C15 C_DRV = SparkFun-Capacitors:2.2UF-10V-20%(0603): CAP-07888; PARTNO: 810-CGA3E1X5R1C225K; PROD_ID: CAP-07888
C16 = SparkFun-Capacitors:10NF/10000PF-50V-10%(0603): CAP-00867; PARTNO: 810-CGA3E2X7R1H103K; PROD_ID: CAP-00867
C-RX2 C-TX2 GP45 GP46 PPS = testpad:TP: Test pad
C_BOOT = SparkFun-Capacitors:33NF-50V-10%(0603): CAP-07887; PARTNO: 810-CGA3E2X7R1H333MA
C_DC5_IN = SparkFun-Capacitors:22UF-25V-20%-(1210): CAP-10381; PARTNO: 81-GRM32ER61E226ME5L; PROD_ID: CAP-10381
C_DC5_OUT1 C_DC5_OUT2 C_OUTS = SparkFun-Capacitors:10UF10V10%(1210): CAP-09824; PARTNO: 810-C3225X7R1E106K; PROD_ID: CAP-09824
C_DC5_SS = SparkFun-Capacitors:270NF-16V(0603): CAP-09137; PARTNO: 81-GRM188R71C274KA1D; PROD_ID: CAP-09137
C_IN = SparkFun-Capacitors:4.7UF-50V(0603): CAP-08280; PARTNO: 810-C2012X5R1E226M; PROD_ID: CAP-08280
C_PMID = SparkFun-Capacitors:1UF-25V-10%(0603): CAP-07886; PARTNO: 810-CGA3E1X7R1E105K; PROD_ID: CAP-07886
C_SYS = SparkFun-Capacitors:10UF16V10%(1210): CAP-09824; PARTNO: 810-C3225X7R1E106K; PROD_ID: CAP-09824
CHARGER = BQ24266:BQ24266; PARTNO: 595-BQ24266RGER
CHARGING D-REC = SparkFun-LED:LED: LEDs Standard schematic elements and footprints for 5mm, 3mm, 1206, and 0603 sized LEDs. 5mm - Spark Fun Electronics SKU : COM-00529 (and others); PARTNO: 604-APT1608SECKJ4PRV
D-ON POWER = SparkFun-LED:LED: LEDs Standard schematic elements and footprints for 5mm, 3mm, 1206, and 0603 sized LEDs. 5mm - Spark Fun Electronics SKU : COM-00529 (and others); PARTNO: 604-APT1608SECKJ3PRV
D-SAT = SparkFun-LED:LED: LEDs Standard schematic elements and footprints for 5mm, 3mm, 1206, and 0603 sized LEDs. 5mm - Spark Fun Electronics SKU : COM-00529 (and others); PARTNO: 604-APT1608ZGCK
D-TRIGGER = SparkFun-LED:LED: LEDs Standard schematic elements and footprints for 5mm, 3mm, 1206, and 0603 sized LEDs. 5mm - Spark Fun Electronics SKU : COM-00529 (and others); PARTNO: 604-APT1608VBC/D
D_IN = SparkFun-DiscreteSemi:V8PAN50-M3/I; PARTNO: NO_PONER
D_IUSB = diode:BAT54C: Schottky Diodes Source: Fairchild .. BAT54.pdf; PARTNO: 512-BAT54C
DC3VLINK = TPS73501DRBT:TPS73501DRBT; PARTNO: 595-TPS73501DRBR
DC5V = TPS61232:TPS61232; PARTNO: 595-TPS61232DRCR
EXT-INTERFACE = droning-passives:M40-3100345R; PARTNO: 855-M40-3100345R
JP-DCIN JP-ENABLE-UART2 JP-SCL JP-SDA = SparkFun-Passives:JUMPER-PAD-3-2OF3_NC_BY_TRACE
JP_LINK = SparkFun-Passives:JUMPER-PAD-2-NO
L_DC5_SW = SparkFun-Inductors:SPR5030T-1R0; PARTNO: 652-SRP5030T-1R0M
L_SW = SparkFun-Inductors:FDSD0420-H-1R5M; PARTNO: 81-FDSD0420-H-1R5MP3
LINK = hoperf:HM-TRLR-S
P_IN = FR014H5JZ:FR014H5JZ; PARTNO: 512-FR014H5JZ
PTC1 = littelfuse:0603L010YR; PARTNO: 576-0603L010YR
PWR = adafruit:JST_PH_G; PARTNO: 455-1749-1-ND
PZ1 = littelfuse:ZEN056V230A16YC; PARTNO: 650-ZEN056V230A16YC
R1-R3 R5 R6 R15 R17 R61 R62 R_ISET1 = SparkFun-Resistors:10KOHM-1/10W-1%(0603): RES-00824; PARTNO: 667-ERJ-3EKF1002V; PROD_ID: RES-00824
R4 R7 R18 = SparkFun-Resistors:100KOHM-1/10W-1%(0603): RES-07828; PARTNO: 594-MCT06030C1003FP5; PROD_ID: RES-07828
R9 = SparkFun-Resistors:147OHM-1/16W-1%(0603): RES-10752; PARTNO: 754-RR0816P-1470D17A; PROD_ID: RES-10752
R10 = SparkFun-Resistors:47KOHM1/10W1%(0603): RES-07871; PARTNO: NO_PONER; PROD_ID: RES-07871
R16 = SparkFun-Resistors:287OHM-1/10W-1%(0603): RES-10752; PARTNO: 667-ERJ-3EKF2870V; PROD_ID: RES-10752
R19 = SparkFun-Resistors:180OHM1/10W1%(0603): RES-08788; PARTNO: 667-ERJ-3GEYJ181V; PROD_ID: RES-08788
R20 R24 = SparkFun-Resistors:105OHM-1/10W-1%(0603): RES-10751; PARTNO: 667-ERJ-3EKF1050V; PROD_ID: RES-10751
R28 = SparkFun-Resistors:82OHM-1/10W-1%(0603): RES-12311; PARTNO: 667-ERJ-3EKF82R0V; PROD_ID: RES-12311
R51 R52 = SparkFun-Resistors:4.7KOHM-1/10W-1%(0603): RES-07857; PARTNO: NO_PONER; PROD_ID: RES-07857
R_CHG R_PG = SparkFun-Resistors:1.8KOHM1/10W1%(0603): RES-09119; PARTNO: 667-ERJ-3GEYJ182V; PROD_ID: RES-09119
R_ISET = SparkFun-Resistors:590OHM1/10W1%(0603): RES-07869; PARTNO: 754-RR0816P-5900D75A; PROD_ID: RES-07869
R_VDPM_B = SparkFun-Resistors:10KOHM-1/10W-0.1%(0603): RES-00824; PARTNO: 667-ERJ-3EKF1002V; PROD_ID: RES-00824
R_VDPM_T = SparkFun-Resistors:71.5KOHM1/10W1%(0603); PARTNO: 667-ERJ-3EKF7152V; PROD_ID: RES-12186
SD = microSD:SDCARD; PARTNO: 538-104031-0811
SREC = pushButton:SKRKAEE010; PARTNO: 688-SKRKAE
T2 T3 = BSS138PS:BSS138PS; AVAILABILITY: Good; DESCRIPTION: MOSFET n-channel dual 60V 320mA TSSOP6; MF: NXP Semiconductors; MP: BSS138PS; PACKAGE: TSSOP-6 NXP Semiconductors; PARTNO: 771-BSS138BKS115; PRICE: 0.19 USD
TRIG-IN = jst-gh:CONN_2-1; PARTNO: 455-1564-1-ND
TRIG-OUT = jst-gh:CONN_7-1; PARTNO: 455-1569-1-ND
TVS1-TVS10 = ESD:LXES15AAA1-133; PARTNO: 81-LXES15AAA1-133
U1 = SparkFun-DigitalIC:LSM9DS0: LSM9DS0 3D Accelerometer, 3D Gyroscope, 3D Magnetomter Features: 3 acceleration channels, 3 angular rate channels, 3 magnetic field channels ±2/±4/±6/±8/±16 g linear acceleration full scale ±2/±4/±8/±12 gauss magnetic full scale ±245/±500/±2000 dps angular rate full scale 16-bit data output SPI / I2C serial interfaces Analog supply voltage 2.4 V to 3.6 V Power-down mode / low-power mode Programmable interrupt generators Embedded self-test Embedded temperature sensor Embedded FIFO Position and motion detection functions Click/double-click recognition; PARTNO: 497-13902-1-ND
U2 = SparkFun-Boards:EDISON_CONNECTOR_FULL; PARTNO: 798-DF40C70DS04V51
U4 = SparkFun-PowerIC:MIC5205: MIC5205 150mA vreg 3.3V - VREG-00822 5V - VREG-00823; PARTNO: 998-MIC5205-3.3YM5TR; PROD_ID: VREG-00822
U7 U9 = TXS0108:TXS0108; PARTNO: 595-TXS0108ERGYR
U$1 = comnav:COMNAV_501G
U$2 = MCX-TEConnectivity:MCX-TECON-1-1337586-0; PARTNO: 571-1-1337586-0
UART-EXT = jst-gh:CONN_4-1; PARTNO: 455-1566-1-ND
USB = 10103594-0001LF:10103594-0001LF: Conn Micro USB Type B RCP 5 POS 0.65mm Solder RA SMD 5 Terminal 1 Port T/R; AVAILABILITY: Good; DESCRIPTION: Conn Micro USB Type B RCP 5 POS 0.65mm Solder RA SMD 5 Terminal 1 Port T/R; MF: FCI; MP: 10103594-0001LF; PACKAGE: None; PARTNO: 649-10103594-0001LF; PRICE: 0.39 USD
X1 = adafruit:ANTENNA_U.FL: U.FL Antenna Connector; PARTNO: 523-A-1JB